# Altium schematic sheet Sheet2.SchDoc
size A4
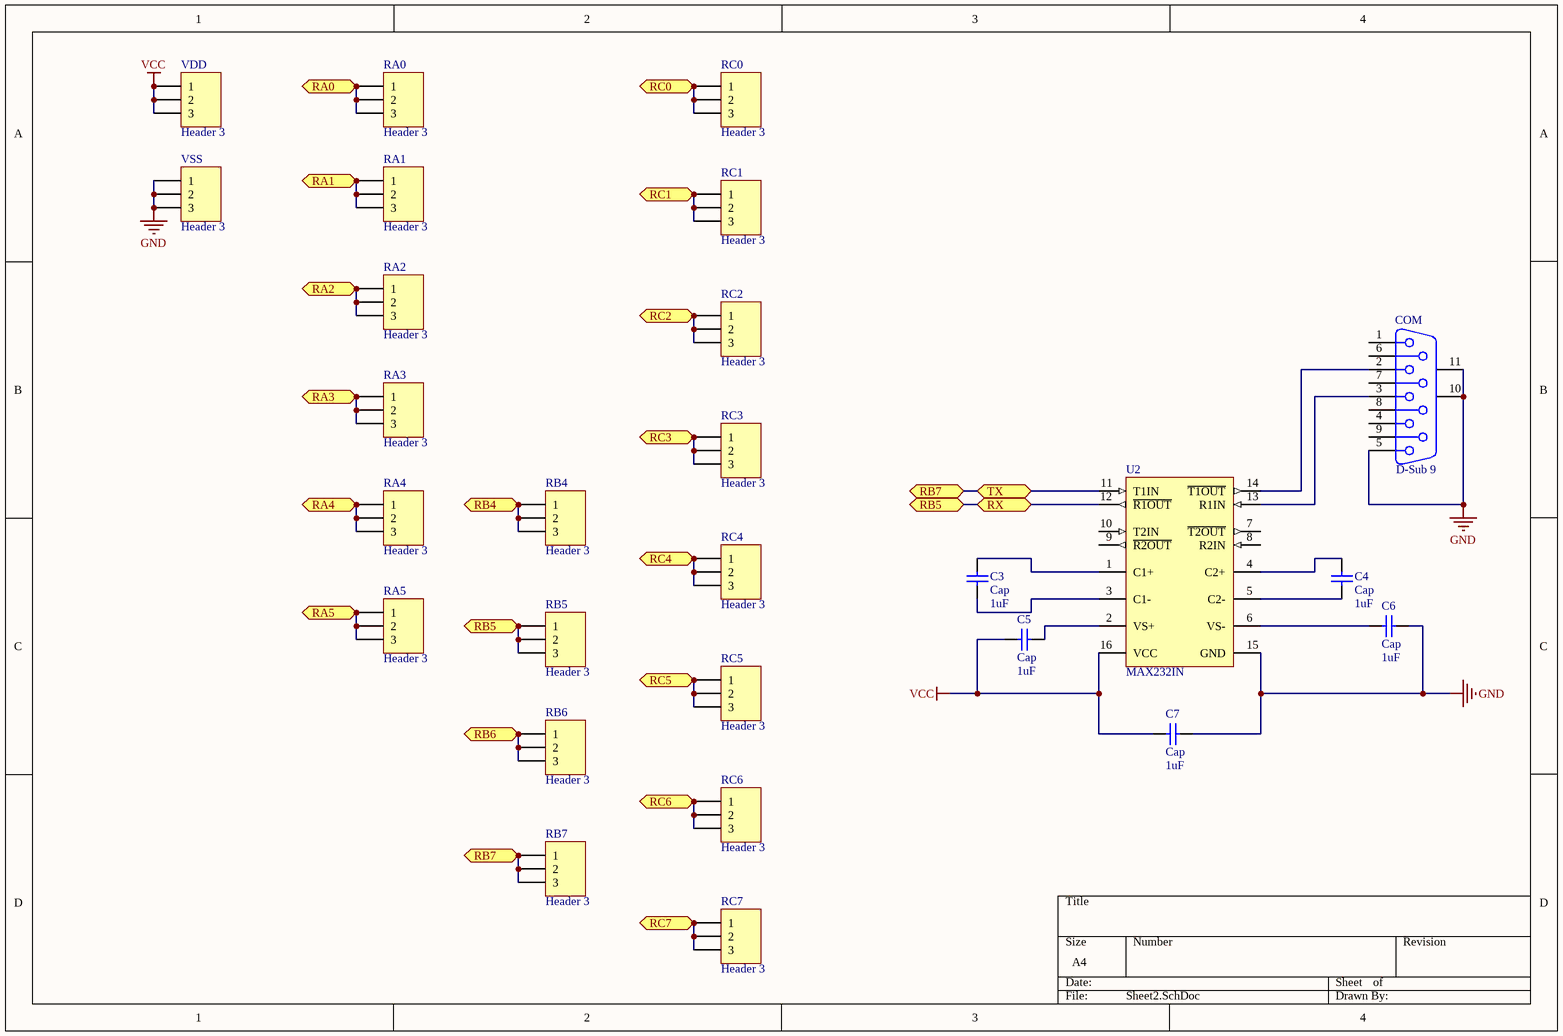
[diagram p0: Sheet2.SchDoc]

## Parts
C3  Cap  value 1uF  [CAP-0.1]
C4  Cap  value 1uF  [CAP-0.1]
C5  Cap  value 1uF  [CAP-0.1]
C6  Cap  value 1uF  [CAP-0.1]
C7  Cap  value 1uF  [CAP-0.1]
COM  D-Sub 9  [DSUB1.385-2H9]
RA0  Header 3  [HDR1X3]
RA1  Header 3  [HDR1X3]
RA2  Header 3  [HDR1X3]
RA3  Header 3  [HDR1X3]
RA4  Header 3  [HDR1X3]
RA5  Header 3  [HDR1X3]
RB4  Header 3  [HDR1X3]
RB5  Header 3  [HDR1X3]
RB6  Header 3  [HDR1X3]
RB7  Header 3  [HDR1X3]
RC0  Header 3  [HDR1X3]
RC1  Header 3  [HDR1X3]
RC2  Header 3  [HDR1X3]
RC3  Header 3  [HDR1X3]
RC4  Header 3  [HDR1X3]
RC5  Header 3  [HDR1X3]
RC6  Header 3  [HDR1X3]
RC7  Header 3  [HDR1X3]
U2  MAX232IN  [N0016A]
VDD  Header 3  [HDR1X3]
VSS  Header 3  [HDR1X3]

## Ports
RA0 (bidir), RA1 (bidir), RA2 (bidir), RA3, RA4 (bidir), RA5 (bidir), RB4 (bidir), RB5 (bidir), RB6 (bidir), RB7 (bidir), RC0 (bidir), RC1 (bidir), RC2 (bidir), RC3 (bidir), RC4 (bidir), RC5 (bidir), RC6 (bidir), RC7 (bidir), RX, TX

## Nets
GND: C6.2 C7.2 COM.5 COM.10(MH1) COM.11(MH2) U2.15(GND) VSS.1 VSS.2 VSS.3
VCC: C5.1 C7.1 U2.16(VCC) VDD.1 VDD.2 VDD.3
RA0: RA0.1 RA0.2 RA0.3 ; port RA0
RA1: RA1.1 RA1.2 RA1.3 ; port RA1
RA2: RA2.1 RA2.2 RA2.3 ; port RA2
RA3: RA3.1 RA3.2 RA3.3 ; port RA3
RA4: RA4.1 RA4.2 RA4.3 ; port RA4
RA5: RA5.1 RA5.2 RA5.3 ; port RA5
RB4: RB4.1 RB4.2 RB4.3 ; port RB4
RB5: RB5.1 RB5.2 RB5.3 U2.12(~{R1OUT}) ; port RB5, port RX
RB6: RB6.1 RB6.2 RB6.3 ; port RB6
RB7: RB7.1 RB7.2 RB7.3 U2.11(T1IN) ; port RB7, port TX
RC0: RC0.1 RC0.2 RC0.3 ; port RC0
RC1: RC1.1 RC1.2 RC1.3 ; port RC1
RC2: RC2.1 RC2.2 RC2.3 ; port RC2
RC3: RC3.1 RC3.2 RC3.3 ; port RC3
RC4: RC4.1 RC4.2 RC4.3 ; port RC4
RC5: RC5.1 RC5.2 RC5.3 ; port RC5
RC6: RC6.1 RC6.2 RC6.3 ; port RC6
RC7: RC7.1 RC7.2 RC7.3 ; port RC7
NetC3_1: C3.1 U2.1(C1+)
NetC3_2: C3.2 U2.3(C1-)
NetC4_1: C4.1 U2.4(C2+)
NetC4_2: C4.2 U2.5(C2-)
NetC5_2: C5.2 U2.2(VS+)
NetC6_1: C6.1 U2.6(VS-)
NetCOM_2: COM.2 U2.14(~{T1OUT})
NetCOM_3: COM.3 U2.13(R1IN)

Not connected (* = marked no-connect by the designer): COM 1 4 6 7 8 9; U2 7(~{T2OUT}) 8(R2IN) 9(~{R2OUT}) 10(T2IN)

## Library data of the parts
C3-C7 = Cap: Capacitor; Published: 8-Jun-2000; LatestRevisionDate: 17-Jul-2002; LatestRevisionNote: Re-released for DXP Platform.; PackageReference: RAD-0.3; Publisher: Altium Limited; PackageDescription: Radial Cap, Thru-Hole; 2 Leads; 0.3 in Pin Spacing; Supplier 1: Mouser; Supplier Part Number 1: 80-C0805C104J5RAUTO
COM = D Connector 9: Receptacle Assembly, 9 Position, Right Angle; PackageDocument: O; Positions: 9; Published: 15-Jun-2001; LatestRevisionDate: 17-Jul-2002; LatestRevisionNote: Re-released for DXP Platform.; DatasheetDocument: 1-Sep-1999; PackageReference: 788750; Publisher: Altium Limited; Orientation: Right Angle; Gender: Receptacle
RA0-RA5 RB4-RB7 RC0-RC7 VDD VSS = Header 3: Header, 3-Pin; LatestRevisionDate: 17-Jul-2002; LatestRevisionNote: Re-released for DXP Platform.; Publisher: Altium Limited
U2 = CMP-0299-00077-2: Dual EIA-232 Driver / Receiver, -40 to 85 degC, 16-Pin PDIP (N), Pb-Free (RoHS); Drivers Per Package: 2; ICC(Max)(mA): 10; RS-232: TRUE; ESD HBM(kV): +/-2; SubFamily: RS-232; Supply Voltage(s)(V): 5; ComponentLink3Description: Package Specification; PackageDescription: 16-Pin Plastic Dual-In-Line Package, Row Spacing 7.62 mm, Pitch 2.54 mm; PackageVersion: revE, Dec-2002; ComponentLink2URL: http://www.ti.com/general/docs/lit/getliterature.tsp?genericPartNumber=MAX232&fileType=pdf; DatasheetVersion: SLLS047L; ComponentLink2Description: Datasheet; ComponentLink3URL: http://www.ti.com/litv/pdf/mpdi002c; ComponentLink1URL: www.ti.com; ComponentLink1Description: Manufacturer URL; PackageReference: N0016A; Single Supply: TRUE; Receivers Per Package: 2